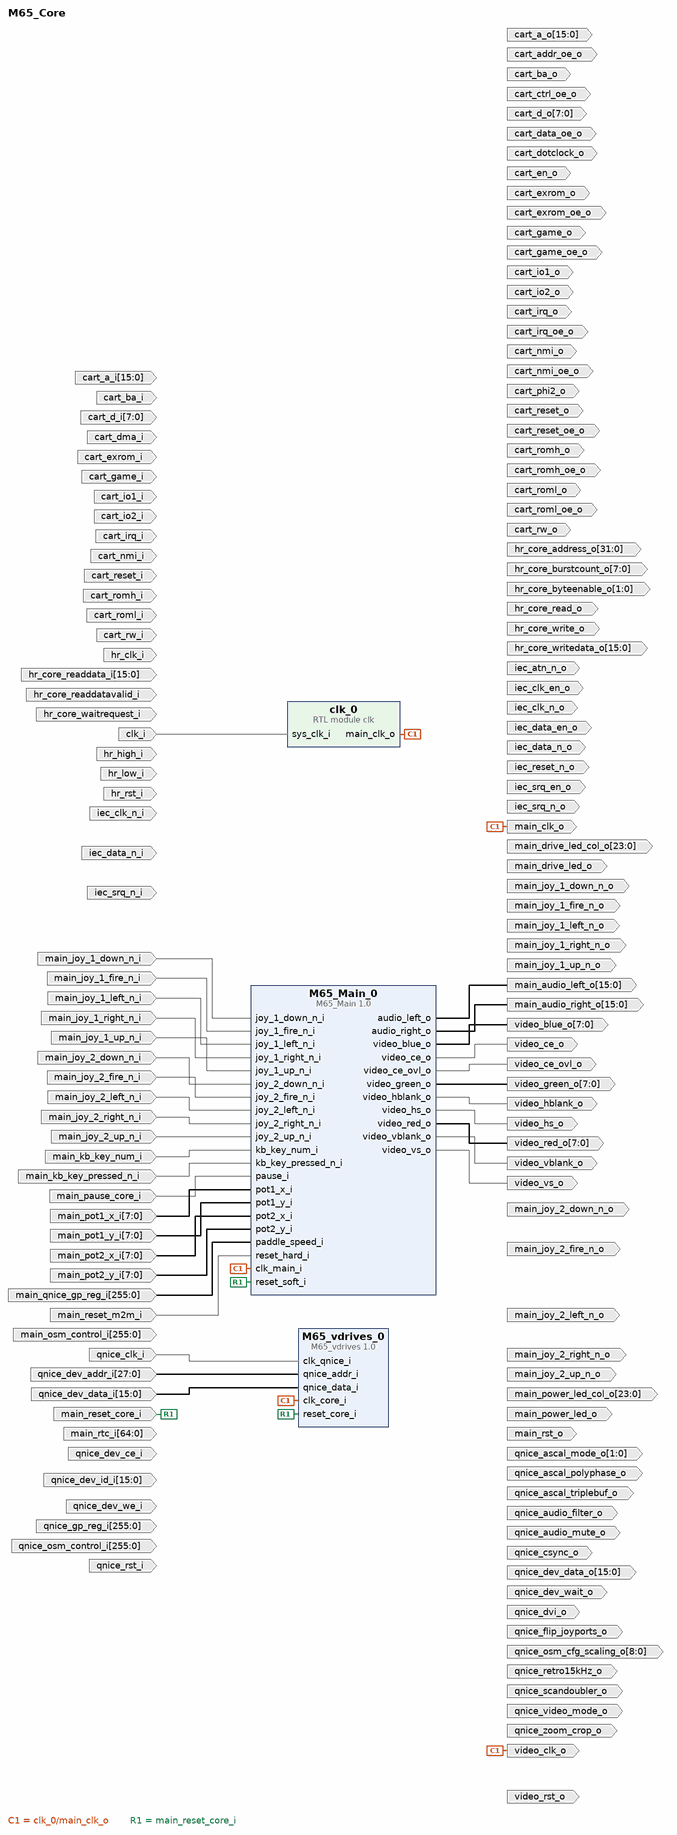
[diagram p0: block diagram of the top level]
# Vivado block design M65_Core, xc7a200tfbg484-3, Vivado 2024.2.1
create_bd_design M65_Core

create_bd_port -dir I -type clk qnice_clk_i
set_property -dict {CONFIG.FREQ_HZ 50000000} [get_bd_ports qnice_clk_i]
create_bd_port -dir I -type rst qnice_rst_i
set_property -dict {CONFIG.POLARITY ACTIVE_HIGH} [get_bd_ports qnice_rst_i]
create_bd_port -dir O qnice_dvi_o
create_bd_port -dir O qnice_video_mode_o
create_bd_port -dir O -from 8 -to 0 qnice_osm_cfg_scaling_o
create_bd_port -dir O qnice_scandoubler_o
create_bd_port -dir O qnice_audio_mute_o
create_bd_port -dir O qnice_audio_filter_o
create_bd_port -dir O qnice_zoom_crop_o
create_bd_port -dir O -from 1 -to 0 qnice_ascal_mode_o
create_bd_port -dir O qnice_ascal_polyphase_o
create_bd_port -dir O qnice_ascal_triplebuf_o
create_bd_port -dir O qnice_retro15kHz_o
create_bd_port -dir O qnice_csync_o
create_bd_port -dir O qnice_flip_joyports_o
create_bd_port -dir I -from 255 -to 0 qnice_osm_control_i
create_bd_port -dir I -from 255 -to 0 qnice_gp_reg_i
create_bd_port -dir I -from 15 -to 0 qnice_dev_id_i
create_bd_port -dir I -from 27 -to 0 qnice_dev_addr_i
create_bd_port -dir I -from 15 -to 0 qnice_dev_data_i
create_bd_port -dir O -from 15 -to 0 qnice_dev_data_o
create_bd_port -dir I qnice_dev_ce_i
create_bd_port -dir I qnice_dev_we_i
create_bd_port -dir O qnice_dev_wait_o
create_bd_port -dir I -type clk hr_clk_i
set_property -dict {CONFIG.FREQ_HZ 100000000} [get_bd_ports hr_clk_i]
create_bd_port -dir I -type rst hr_rst_i
set_property -dict {CONFIG.POLARITY ACTIVE_HIGH} [get_bd_ports hr_rst_i]
create_bd_port -dir O hr_core_write_o
create_bd_port -dir O hr_core_read_o
create_bd_port -dir O -from 31 -to 0 hr_core_address_o
create_bd_port -dir O -from 15 -to 0 hr_core_writedata_o
create_bd_port -dir O -from 1 -to 0 hr_core_byteenable_o
create_bd_port -dir O -from 7 -to 0 hr_core_burstcount_o
create_bd_port -dir I -from 15 -to 0 hr_core_readdata_i
create_bd_port -dir I hr_core_readdatavalid_i
create_bd_port -dir I hr_core_waitrequest_i
create_bd_port -dir I hr_high_i
create_bd_port -dir I hr_low_i
create_bd_port -dir O -type clk video_clk_o
create_bd_port -dir O -type rst video_rst_o
create_bd_port -dir O video_ce_o
create_bd_port -dir O video_ce_ovl_o
create_bd_port -dir O -from 7 -to 0 video_red_o
create_bd_port -dir O -from 7 -to 0 video_green_o
create_bd_port -dir O -from 7 -to 0 video_blue_o
create_bd_port -dir O video_vs_o
create_bd_port -dir O video_hs_o
create_bd_port -dir O video_hblank_o
create_bd_port -dir O video_vblank_o
create_bd_port -dir I -type clk clk_i
set_property -dict {CONFIG.FREQ_HZ 100000000} [get_bd_ports clk_i]
create_bd_port -dir O -type clk main_clk_o
create_bd_port -dir O -type rst main_rst_o
create_bd_port -dir I -type rst main_reset_m2m_i
set_property -dict {CONFIG.POLARITY ACTIVE_HIGH} [get_bd_ports main_reset_m2m_i]
create_bd_port -dir I -type rst main_reset_core_i
set_property -dict {CONFIG.POLARITY ACTIVE_HIGH} [get_bd_ports main_reset_core_i]
create_bd_port -dir I main_pause_core_i
create_bd_port -dir I -from 255 -to 0 main_osm_control_i
create_bd_port -dir I -from 255 -to 0 main_qnice_gp_reg_i
create_bd_port -dir O -from 15 -to 0 main_audio_left_o
create_bd_port -dir O -from 15 -to 0 main_audio_right_o
create_bd_port -dir I main_kb_key_num_i
create_bd_port -dir I main_kb_key_pressed_n_i
create_bd_port -dir O main_power_led_o
create_bd_port -dir O main_drive_led_o
create_bd_port -dir O -from 23 -to 0 main_drive_led_col_o
create_bd_port -dir O -from 23 -to 0 main_power_led_col_o
create_bd_port -dir I main_joy_1_up_n_i
create_bd_port -dir I main_joy_1_down_n_i
create_bd_port -dir I main_joy_1_left_n_i
create_bd_port -dir I main_joy_1_right_n_i
create_bd_port -dir I main_joy_1_fire_n_i
create_bd_port -dir O main_joy_1_up_n_o
create_bd_port -dir O main_joy_1_down_n_o
create_bd_port -dir O main_joy_1_left_n_o
create_bd_port -dir O main_joy_1_right_n_o
create_bd_port -dir O main_joy_1_fire_n_o
create_bd_port -dir I main_joy_2_up_n_i
create_bd_port -dir I main_joy_2_down_n_i
create_bd_port -dir I main_joy_2_left_n_i
create_bd_port -dir I main_joy_2_right_n_i
create_bd_port -dir I main_joy_2_fire_n_i
create_bd_port -dir O main_joy_2_up_n_o
create_bd_port -dir O main_joy_2_down_n_o
create_bd_port -dir O main_joy_2_left_n_o
create_bd_port -dir O main_joy_2_right_n_o
create_bd_port -dir O main_joy_2_fire_n_o
create_bd_port -dir I -from 7 -to 0 main_pot1_x_i
create_bd_port -dir I -from 7 -to 0 main_pot1_y_i
create_bd_port -dir I -from 7 -to 0 main_pot2_x_i
create_bd_port -dir I -from 7 -to 0 main_pot2_y_i
create_bd_port -dir I -from 64 -to 0 main_rtc_i
create_bd_port -dir O -type rst iec_reset_n_o
create_bd_port -dir O iec_atn_n_o
create_bd_port -dir O -type clk iec_clk_en_o
create_bd_port -dir I -type clk iec_clk_n_i
set_property -dict {CONFIG.FREQ_HZ 100000000} [get_bd_ports iec_clk_n_i]
create_bd_port -dir O -type clk iec_clk_n_o
create_bd_port -dir O iec_data_en_o
create_bd_port -dir I iec_data_n_i
create_bd_port -dir O iec_data_n_o
create_bd_port -dir O iec_srq_en_o
create_bd_port -dir I iec_srq_n_i
create_bd_port -dir O iec_srq_n_o
create_bd_port -dir O cart_en_o
create_bd_port -dir O cart_phi2_o
create_bd_port -dir O -type clk cart_dotclock_o
create_bd_port -dir I cart_dma_i
create_bd_port -dir O -type rst cart_reset_oe_o
create_bd_port -dir I -type rst cart_reset_i
set_property -dict {CONFIG.POLARITY ACTIVE_HIGH} [get_bd_ports cart_reset_i]
create_bd_port -dir O -type rst cart_reset_o
create_bd_port -dir O cart_game_oe_o
create_bd_port -dir I cart_game_i
create_bd_port -dir O cart_game_o
create_bd_port -dir O cart_exrom_oe_o
create_bd_port -dir I cart_exrom_i
create_bd_port -dir O cart_exrom_o
create_bd_port -dir O cart_nmi_oe_o
create_bd_port -dir I cart_nmi_i
create_bd_port -dir O cart_nmi_o
create_bd_port -dir O cart_irq_oe_o
create_bd_port -dir I cart_irq_i
create_bd_port -dir O cart_irq_o
create_bd_port -dir O cart_roml_oe_o
create_bd_port -dir I cart_roml_i
create_bd_port -dir O cart_roml_o
create_bd_port -dir O cart_romh_oe_o
create_bd_port -dir I cart_romh_i
create_bd_port -dir O cart_romh_o
create_bd_port -dir O cart_ctrl_oe_o
create_bd_port -dir I cart_ba_i
create_bd_port -dir I cart_rw_i
create_bd_port -dir I cart_io1_i
create_bd_port -dir I cart_io2_i
create_bd_port -dir O cart_ba_o
create_bd_port -dir O cart_rw_o
create_bd_port -dir O cart_io1_o
create_bd_port -dir O cart_io2_o
create_bd_port -dir O cart_addr_oe_o
create_bd_port -dir I -from 15 -to 0 cart_a_i
create_bd_port -dir O -from 15 -to 0 cart_a_o
create_bd_port -dir O cart_data_oe_o
create_bd_port -dir I -from 7 -to 0 cart_d_i
create_bd_port -dir O -from 7 -to 0 cart_d_o

create_bd_cell -type ip -vlnv xilinx.com:user:M65_Main:1.0 M65_Main_0
create_bd_cell -type module -reference clk clk_0
create_bd_cell -type ip -vlnv xilinx.com:user:M65_vdrives:1.0 M65_vdrives_0

# ---- connections ----

connect_bd_net [get_bd_pins M65_Main_0/audio_left_o] [get_bd_ports main_audio_left_o]
connect_bd_net [get_bd_pins M65_Main_0/audio_right_o] [get_bd_ports main_audio_right_o]
connect_bd_net [get_bd_pins M65_Main_0/video_blue_o] [get_bd_ports video_blue_o]
connect_bd_net [get_bd_pins M65_Main_0/video_ce_o] [get_bd_ports video_ce_o]
connect_bd_net [get_bd_pins M65_Main_0/video_ce_ovl_o] [get_bd_ports video_ce_ovl_o]
connect_bd_net [get_bd_pins M65_Main_0/video_green_o] [get_bd_ports video_green_o]
connect_bd_net [get_bd_pins M65_Main_0/video_hblank_o] [get_bd_ports video_hblank_o]
connect_bd_net [get_bd_pins M65_Main_0/video_hs_o] [get_bd_ports video_hs_o]
connect_bd_net [get_bd_pins M65_Main_0/video_red_o] [get_bd_ports video_red_o]
connect_bd_net [get_bd_pins M65_Main_0/video_vblank_o] [get_bd_ports video_vblank_o]
connect_bd_net [get_bd_pins M65_Main_0/video_vs_o] [get_bd_ports video_vs_o]
connect_bd_net [get_bd_pins clk_0/main_clk_o] \
  [get_bd_ports main_clk_o] [get_bd_ports video_clk_o] [get_bd_pins M65_Main_0/clk_main_i] \
  [get_bd_pins M65_vdrives_0/clk_core_i]
connect_bd_net [get_bd_ports clk_i] [get_bd_pins clk_0/sys_clk_i]
connect_bd_net [get_bd_ports main_joy_1_down_n_i] [get_bd_pins M65_Main_0/joy_1_down_n_i]
connect_bd_net [get_bd_ports main_joy_1_fire_n_i] [get_bd_pins M65_Main_0/joy_1_fire_n_i]
connect_bd_net [get_bd_ports main_joy_1_left_n_i] [get_bd_pins M65_Main_0/joy_1_left_n_i]
connect_bd_net [get_bd_ports main_joy_1_right_n_i] [get_bd_pins M65_Main_0/joy_1_right_n_i]
connect_bd_net [get_bd_ports main_joy_1_up_n_i] [get_bd_pins M65_Main_0/joy_1_up_n_i]
connect_bd_net [get_bd_ports main_joy_2_down_n_i] [get_bd_pins M65_Main_0/joy_2_down_n_i]
connect_bd_net [get_bd_ports main_joy_2_fire_n_i] [get_bd_pins M65_Main_0/joy_2_fire_n_i]
connect_bd_net [get_bd_ports main_joy_2_left_n_i] [get_bd_pins M65_Main_0/joy_2_left_n_i]
connect_bd_net [get_bd_ports main_joy_2_right_n_i] [get_bd_pins M65_Main_0/joy_2_right_n_i]
connect_bd_net [get_bd_ports main_joy_2_up_n_i] [get_bd_pins M65_Main_0/joy_2_up_n_i]
connect_bd_net [get_bd_ports main_kb_key_num_i] [get_bd_pins M65_Main_0/kb_key_num_i]
connect_bd_net [get_bd_ports main_kb_key_pressed_n_i] [get_bd_pins M65_Main_0/kb_key_pressed_n_i]
connect_bd_net [get_bd_ports main_pause_core_i] [get_bd_pins M65_Main_0/pause_i]
connect_bd_net [get_bd_ports main_pot1_x_i] [get_bd_pins M65_Main_0/pot1_x_i]
connect_bd_net [get_bd_ports main_pot1_y_i] [get_bd_pins M65_Main_0/pot1_y_i]
connect_bd_net [get_bd_ports main_pot2_x_i] [get_bd_pins M65_Main_0/pot2_x_i]
connect_bd_net [get_bd_ports main_pot2_y_i] [get_bd_pins M65_Main_0/pot2_y_i]
connect_bd_net [get_bd_ports main_qnice_gp_reg_i] [get_bd_pins M65_Main_0/paddle_speed_i]
connect_bd_net [get_bd_ports main_reset_core_i] [get_bd_pins M65_Main_0/reset_soft_i] [get_bd_pins M65_vdrives_0/reset_core_i]
connect_bd_net [get_bd_ports main_reset_m2m_i] [get_bd_pins M65_Main_0/reset_hard_i]
connect_bd_net [get_bd_ports qnice_clk_i] [get_bd_pins M65_vdrives_0/clk_qnice_i]
connect_bd_net [get_bd_ports qnice_dev_addr_i] [get_bd_pins M65_vdrives_0/qnice_addr_i]
connect_bd_net [get_bd_ports qnice_dev_data_i] [get_bd_pins M65_vdrives_0/qnice_data_i]

validate_bd_design
save_bd_design
